# EAGLE design PiKVM_USB_Adapter v1 (EAGLE 9.6.2)
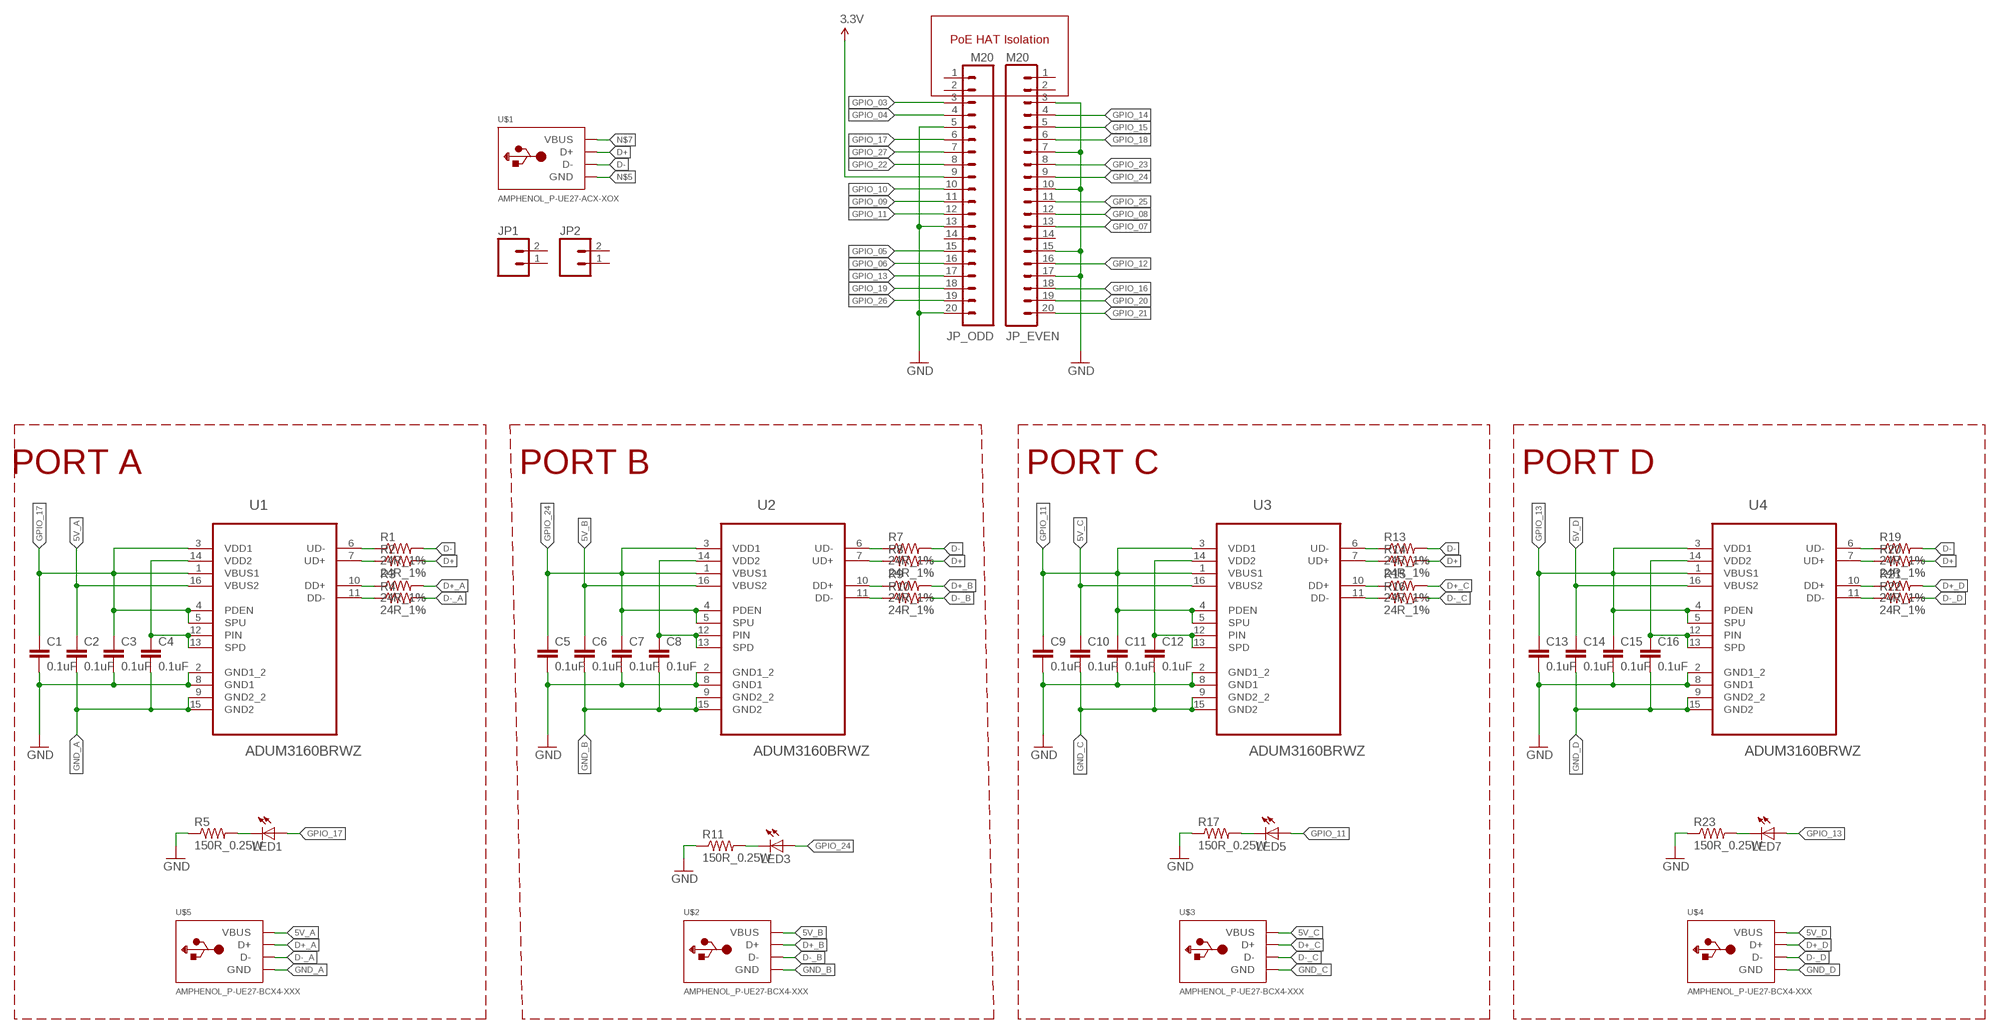
[diagram p0: schematic, sheet 1]

## Parts
C1  0.1uF  CAP0805  [0805]
C2  0.1uF  CAP0805  [0805]
C3  0.1uF  CAP0805  [0805]
C4  0.1uF  CAP0805  [0805]
C5  0.1uF  CAP0805  [0805]
C6  0.1uF  CAP0805  [0805]
C7  0.1uF  CAP0805  [0805]
C8  0.1uF  CAP0805  [0805]
C9  0.1uF  CAP0805  [0805]
C10  0.1uF  CAP0805  [0805]
C11  0.1uF  CAP0805  [0805]
C12  0.1uF  CAP0805  [0805]
C13  0.1uF  CAP0805  [0805]
C14  0.1uF  CAP0805  [0805]
C15  0.1uF  CAP0805  [0805]
C16  0.1uF  CAP0805  [0805]
JP1  M02LOCK  [1X02_LOCK]
JP2  M02LOCK  [1X02_LOCK]
JP_EVEN  M20  [1X20]
JP_ODD  M20  [1X20]
LED1  LED1206  [LED-1206]
LED3  LED1206  [LED-1206]
LED5  LED1206  [LED-1206]
LED7  LED1206  [LED-1206]
R1  24R_1%  RESISTOR0805-RES  [0805]
R2  24R_1%  RESISTOR0805-RES  [0805]
R3  24R_1%  RESISTOR0805-RES  [0805]
R4  24R_1%  RESISTOR0805-RES  [0805]
R5  150R_0.25W  RESISTOR1206  [1206]
R7  24R_1%  RESISTOR0805-RES  [0805]
R8  24R_1%  RESISTOR0805-RES  [0805]
R9  24R_1%  RESISTOR0805-RES  [0805]
R10  24R_1%  RESISTOR0805-RES  [0805]
R11  150R_0.25W  RESISTOR1206  [1206]
R13  24R_1%  RESISTOR0805-RES  [0805]
R14  24R_1%  RESISTOR0805-RES  [0805]
R15  24R_1%  RESISTOR0805-RES  [0805]
R16  24R_1%  RESISTOR0805-RES  [0805]
R17  150R_0.25W  RESISTOR1206  [1206]
R19  24R_1%  RESISTOR0805-RES  [0805]
R20  24R_1%  RESISTOR0805-RES  [0805]
R21  24R_1%  RESISTOR0805-RES  [0805]
R22  24R_1%  RESISTOR0805-RES  [0805]
R23  150R_0.25W  RESISTOR1206  [1206]
U1  ADUM3160BRWZ  [SOIC127P1032X265-16N]
U2  ADUM3160BRWZ  [SOIC127P1032X265-16N]
U3  ADUM3160BRWZ  [SOIC127P1032X265-16N]
U4  ADUM3160BRWZ  [SOIC127P1032X265-16N]
U$1  AMPHENOL_P-UE27-ACX-XOX  [USBA_AMPHENOL-UE27-RA]
U$2  AMPHENOL_P-UE27-BCX4-XXX  [USBB_AMPHENOL-UE27-BC]
U$3  AMPHENOL_P-UE27-BCX4-XXX  [USBB_AMPHENOL-UE27-BC]
U$4  AMPHENOL_P-UE27-BCX4-XXX  [USBB_AMPHENOL-UE27-BC]
U$5  AMPHENOL_P-UE27-BCX4-XXX  [USBB_AMPHENOL-UE27-BC]

## Nets
3.3V: JP_ODD.9
5V_A: C2.1 U1.16(VBUS2) U$5.P$1(VBUS)
5V_B: C6.1 U2.16(VBUS2) U$2.P$1(VBUS)
5V_C: C10.1 U3.16(VBUS2) U$3.P$1(VBUS)
5V_D: C14.1 U4.16(VBUS2) U$4.P$1(VBUS)
D+: R2.2 R8.2 R14.2 R20.2 U$1.P$3(D+)
D+_A: R3.2 U$5.P$3(D+)
D+_B: R9.2 U$2.P$3(D+)
D+_C: R15.2 U$3.P$3(D+)
D+_D: R21.2 U$4.P$3(D+)
D-: R1.2 R7.2 R13.2 R19.2 U$1.P$2(D-)
D-_A: R4.2 U$5.P$2(D-)
D-_B: R10.2 U$2.P$2(D-)
D-_C: R16.2 U$3.P$2(D-)
D-_D: R22.2 U$4.P$2(D-)
GND: C1.2 C3.2 C5.2 C7.2 C9.2 C11.2 C13.2 C15.2 JP_EVEN.3 JP_EVEN.7 JP_EVEN.10 JP_EVEN.15 JP_EVEN.17 JP_ODD.5 JP_ODD.13 JP_ODD.20 R5.1 R11.1 R17.1 R23.1 U1.2(GND1_2) U1.8(GND1) U2.2(GND1_2) U2.8(GND1) U3.2(GND1_2) U3.8(GND1) U4.2(GND1_2) U4.8(GND1)
GND_A: C2.2 C4.2 U1.9(GND2_2) U1.15(GND2) U$5.P$4(GND)
GND_B: C6.2 C8.2 U2.9(GND2_2) U2.15(GND2) U$2.P$4(GND)
GND_C: C10.2 C12.2 U3.9(GND2_2) U3.15(GND2) U$3.P$4(GND)
GND_D: C14.2 C16.2 U4.9(GND2_2) U4.15(GND2) U$4.P$4(GND)
GPIO_03: JP_ODD.3
GPIO_04: JP_ODD.4
GPIO_05: JP_ODD.15
GPIO_06: JP_ODD.16
GPIO_07: JP_EVEN.13
GPIO_08: JP_EVEN.12
GPIO_09: JP_ODD.11
GPIO_10: JP_ODD.10
GPIO_11: C9.1 C11.1 JP_ODD.12 LED5.A U3.1(VBUS1) U3.3(VDD1) U3.4(PDEN) U3.5(SPU)
GPIO_12: JP_EVEN.16
GPIO_13: C13.1 C15.1 JP_ODD.17 LED7.A U4.1(VBUS1) U4.3(VDD1) U4.4(PDEN) U4.5(SPU)
GPIO_14: JP_EVEN.4
GPIO_15: JP_EVEN.5
GPIO_16: JP_EVEN.18
GPIO_17: C1.1 C3.1 JP_ODD.6 LED1.A U1.1(VBUS1) U1.3(VDD1) U1.4(PDEN) U1.5(SPU)
GPIO_18: JP_EVEN.6
GPIO_19: JP_ODD.18
GPIO_20: JP_EVEN.19
GPIO_21: JP_EVEN.20
GPIO_22: JP_ODD.8
GPIO_23: JP_EVEN.8
GPIO_24: C5.1 C7.1 JP_EVEN.9 LED3.A U2.1(VBUS1) U2.3(VDD1) U2.4(PDEN) U2.5(SPU)
GPIO_25: JP_EVEN.11
GPIO_26: JP_ODD.19
GPIO_27: JP_ODD.7
N$1: C8.1 U2.12(PIN) U2.13(SPD) U2.14(VDD2)
N$2: R7.1 U2.6(UD-)
N$3: R8.1 U2.7(UD+)
N$4: R9.1 U2.10(DD+)
N$5: U$1.P$4(GND)
N$6: R10.1 U2.11(DD-)
N$7: U$1.P$1(VBUS)
N$8: LED3.C R11.2
N$9: C12.1 U3.12(PIN) U3.13(SPD) U3.14(VDD2)
N$10: R13.1 U3.6(UD-)
N$11: R14.1 U3.7(UD+)
N$12: R15.1 U3.10(DD+)
N$13: R16.1 U3.11(DD-)
N$15: LED5.C R17.2
N$16: C16.1 U4.12(PIN) U4.13(SPD) U4.14(VDD2)
N$17: R19.1 U4.6(UD-)
N$18: LED1.C R5.2
N$19: C4.1 U1.12(PIN) U1.13(SPD) U1.14(VDD2)
N$20: R20.1 U4.7(UD+)
N$21: R21.1 U4.10(DD+)
N$22: R22.1 U4.11(DD-)
N$23: R1.1 U1.6(UD-)
N$24: R2.1 U1.7(UD+)
N$25: R3.1 U1.10(DD+)
N$26: R4.1 U1.11(DD-)
N$28: LED7.C R23.2
Unconnected: JP1.1 JP1.2 JP2.1 JP2.2 JP_EVEN.1 JP_EVEN.2 JP_EVEN.14 JP_ODD.1 JP_ODD.2 JP_ODD.14

## Notes on the sheet
- PoE HAT Isolation
- PORT A | PORT B | PORT C | PORT D

## Library data of the parts
C1-C16 = SparkFun-Capacitors:CAP: Capacitor Standard 0603 ceramic capacitor, and 0.1" leaded capacitor.
JP1 JP2 = SparkFun-Connectors:M02: Header 2 Standard 2-pin 0.1" header. Use with straight break away headers (SKU : PRT-00116), right angle break away headers (PRT-00553), swiss pins (PRT-00743), machine pins (PRT-00117), and female headers (PRT-00115). Molex polarized connector foot print use with SKU : PRT-08233 with associated crimp pins and housings.
JP_EVEN JP_ODD = SparkFun-Connectors:M20: 1x20 .1" header This is just like the LOCK variant in that the holes are staggared by 5 mil, but except for the last two holes. They are not altered from the "standard" footprint layout. This is used for a special purpose on the layout of our Graphic LCD Backpack. Make sure you want to use this device before selecting it for you project!
LED1 LED3 LED5 LED7 = SparkFun-LED:LED: LEDs Standard schematic elements and footprints for 5mm, 3mm, 1206, and 0603 sized LEDs. 5mm - Spark Fun Electronics SKU : COM-00529 (and others)
R1-R5 R7-R11 R13-R17 R19-R23 = SparkFun-Resistors:RESISTOR: Resistor Basic schematic elements and footprints for 0603, 1206, and PTH resistors.
U1-U4 = Analog Devices_By_element14_Batch_1:ADUM3160BRWZ: Full/Low Speed 2.5 kV USB Digital Isolator; MPN: ADUM3160BRWZ; OC_FARNELL: 1843660; OC_NEWARK: 85R6420; PACKAGE: SOIC-16; SUPPLIER: Analog Devices
U$1 = adafruit:AMPHENOL_P-UE27-ACX-XOX
U$2-U$5 = adafruit:AMPHENOL_P-UE27-BCX4-XXX

## Board
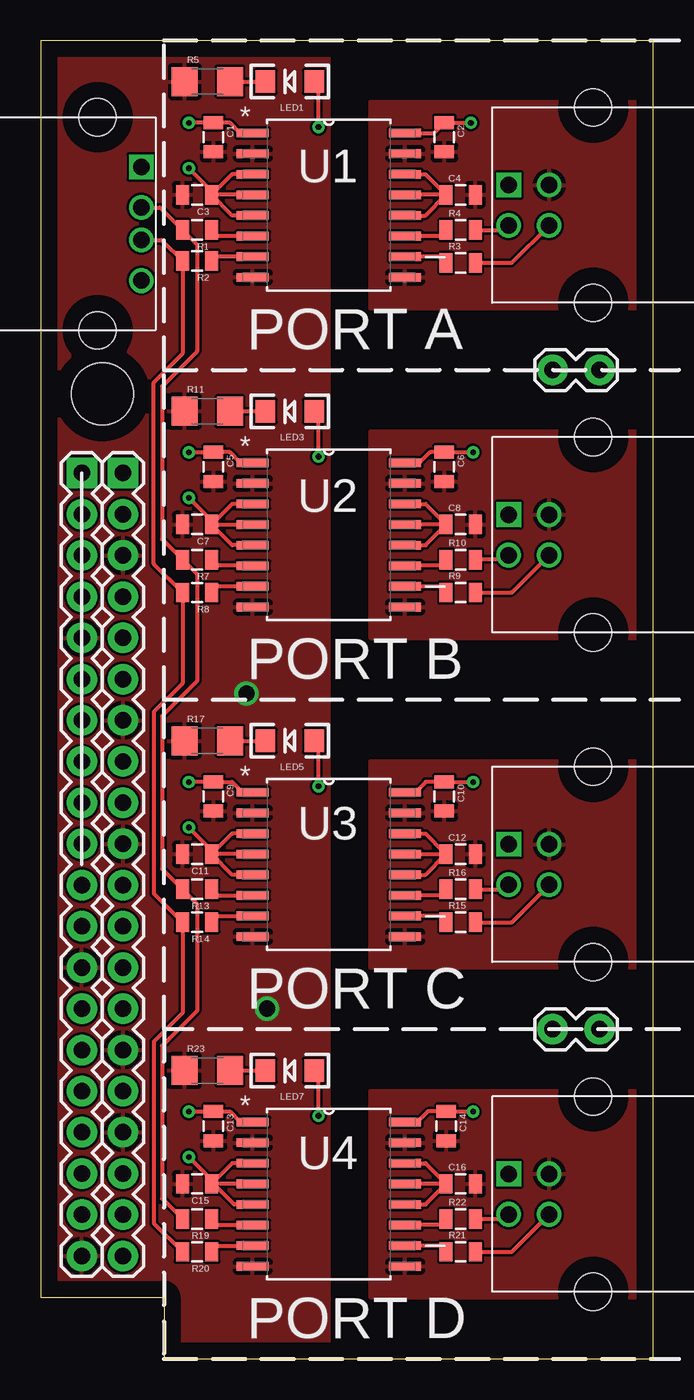
[diagram p1: board, top side]
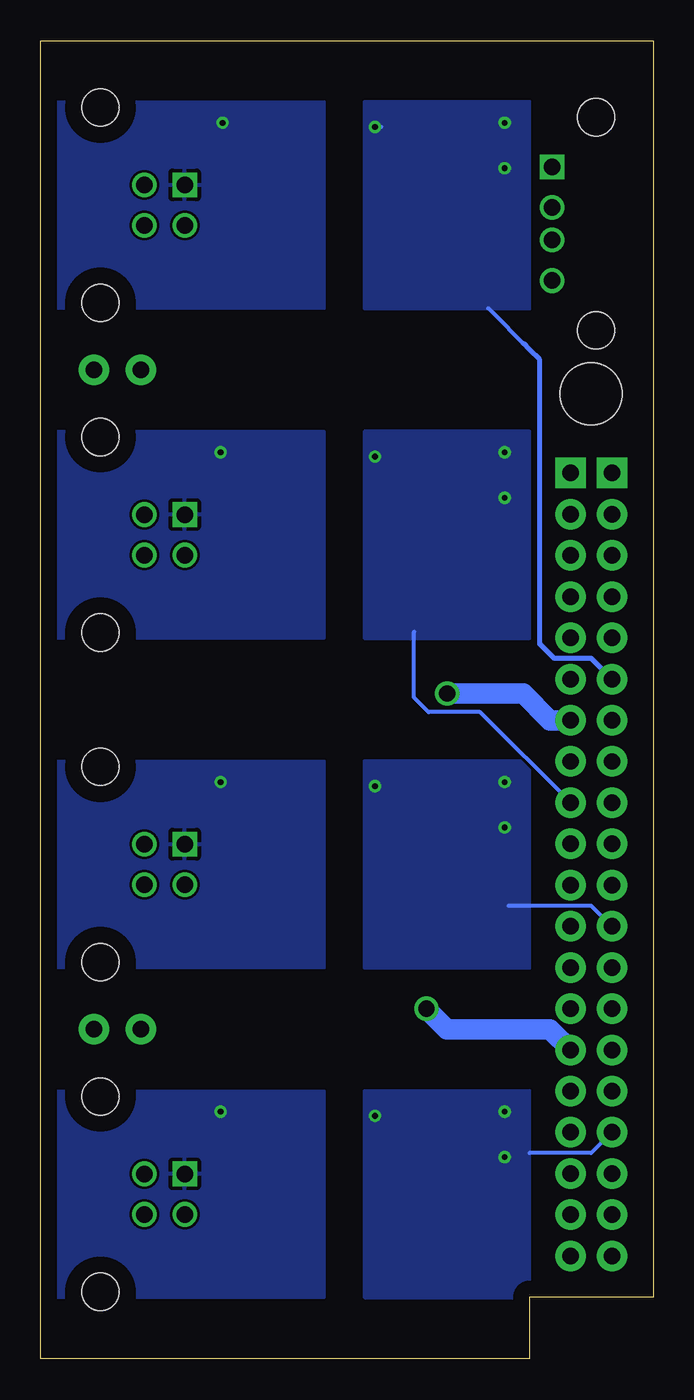
[diagram p2: board, bottom side, seen from below]

Size 37.77 x 81.27 mm. Coordinates in mm from the lower left corner, seen from the top.
Outline: 0,3.81 7.62,3.81 7.62,0 37.77,0 37.77,81.27 0,81.27 0,3.81
Copper layers (1*16): Top 0.035mm / dielectric 1.5mm / Bottom 0.035mm
Design rules "default": minimum track width 6mil, minimum drill 0.35mm, track to track 6mil, track to pad 6mil, pad to pad 6mil, via to via 6mil, smd to smd 6mil, copper to edge 40mil, drill to drill 6mil, minimum pad ring 10mil, minimum via ring 8mil, stop-mask expansion 4mil, vias tented up to drill 0mil, thermal gap 10mil
Holes 3.81 mm at 3.81,59.49

### Footprints (pad centres in the part's own frame; a part is rotated, then mirrored left to right if it is on the bottom)
0805 = smd 0.8 x 1.2: 1 -0.9,0; 2 0.9,0
1X02_LOCK = drill 1.016 pad 1.88: 1 -0.178,0; 2 2.718,0
1X20 = drill 1.016 pad 1.88 square: 1 0,0 | drill 1.016 pad 1.88: 2 2.54,0; 3 5.08,0; 4 7.62,0; 5 10.16,0; 6 12.7,0; 7 15.24,0; 8 17.78,0; 9 20.32,0; 10 22.86,0; 11 25.4,0; 12 27.94,0; 13 30.48,0; 14 33.02,0; 15 35.56,0; 16 38.1,0; 17 40.64,0; 18 43.18,0; 19 45.72,0; 20 48.26,0
LED-1206 = smd 1.2 x 1.4: A -1.5,0; C 1.5,0
1206 = smd 1.6 x 1.8: 1 -1.4,0; 2 1.4,0
SOIC127P1032X265-16N = smd 1.981 x 0.533: 1 -4.699,4.445; 2 -4.699,3.175; 3 -4.699,1.905; 4 -4.699,0.635; 5 -4.699,-0.635; 6 -4.699,-1.905; 7 -4.699,-3.175; 8 -4.699,-4.445; 9 4.699,-4.445; 10 4.699,-3.175; 11 4.699,-1.905; 12 4.699,-0.635; 13 4.699,0.635; 14 4.699,1.905; 15 4.699,3.175; 16 4.699,4.445
USBA_AMPHENOL-UE27-RA = drill 1.016 square: P$1 -3.5,0 | drill 1.016: P$2 -1.001,0; P$3 1.001,0; P$4 3.5,0 | hole 2.286: -6.571,-2.71; 6.571,-2.71
USBB_AMPHENOL-UE27-BC = drill 1.016 square: P$1 1.25,2.492 | drill 1.016: P$2 -1.25,2.499; P$3 -1.25,0; P$4 1.25,0 | hole 2.286: -6.02,-2.71; 6.02,-2.71

### Placement (x,y rotation side)
C1  10.67,75.31 270 top
C2  24.89,75.31 270 top
C3  9.65,71.75 180 top
C4  25.91,71.75 0 top
C5  10.67,54.99 270 top
C6  24.89,54.99 270 top
C7  9.65,51.43 180 top
C8  25.91,51.43 0 top
C9  10.67,34.67 270 top
C10  24.89,34.67 270 top
C11  9.65,31.12 180 top
C12  25.91,31.12 0 top
C13  10.67,14.35 270 top
C14  25.02,14.35 270 top
C15  9.65,10.79 180 top
C16  25.91,10.79 0 top
JP1  31.75,60.96 0 top
JP2  31.75,20.32 0 top
JP_EVEN  5.08,54.61 270 top
JP_ODD  2.54,54.61 270 top
LED1  15.37,78.74 180 top
LED3  15.37,58.42 180 top
LED5  15.37,38.1 180 top
LED7  15.37,17.78 180 top
R1  9.65,69.6 180 top
R2  9.65,67.69 180 top
R3  25.91,67.56 0 top
R4  25.91,69.6 0 top
R5  10.29,78.74 0 top
R7  9.65,49.28 180 top
R8  9.65,47.24 180 top
R9  25.91,47.24 0 top
R10  25.91,49.28 0 top
R11  10.29,58.42 0 top
R13  9.65,28.96 180 top
R14  9.65,26.92 180 top
R15  25.91,26.92 0 top
R16  25.91,28.96 0 top
R17  10.29,38.1 0 top
R19  9.65,8.64 180 top
R20  9.65,6.6 180 top
R21  25.91,6.6 0 top
R22  25.91,8.64 0 top
R23  10.29,17.78 0 top
U1  17.78,71.12 0 top
U2  17.78,50.8 0 top
U3  17.78,30.48 0 top
U4  17.78,10.16 0 top
U$1  6.22,69.98 270 top
U$2  31.37,50.8 90 top
U$3  31.37,30.48 90 top
U$4  31.37,10.16 90 top
U$5  31.37,71.12 90 top

### Tracks (layer width: path | path; a pad name or v marks a point on that pad's centre or on a via)
5V_A  (via drill 0.35)
  Top 0.254: 22.49,75.58 U1.16 24.25,75.56 C2.1 26.53,76.21 v26.54,76.2
  Bottom 0.254: v26.54,76.2 26.8,76.2
  Bottom 0.305: U$5.P$1 28.85,72.37
  pour Bottom: 20.32,64.77 38.1,64.77 38.1,77.47 20.32,77.47
5V_B  (via drill 0.35)
  Top 0.254: v26.67,55.88 26.66,55.89 C6.1 24.01,55.89 23.37,55.24 U2.16
  pour Bottom: 20.32,44.45 38.1,44.45 38.1,57.15 20.32,57.15
5V_C  (via drill 0.35)
  Top 0.254: U3.16 23.11,34.92 23.76,35.57 C10.1 26.66,35.57 v26.67,35.56
  pour Bottom: 20.32,24.13 38.1,24.13 38.1,36.83 20.32,36.83
5V_D  (via drill 0.35)
  Top 0.254: U4.16 23.24,14.6 23.89,15.25 C14.1 26.66,15.25 v26.67,15.24
  pour Bottom: 20.32,3.81 38.1,3.81 38.1,16.51 20.32,16.51
D+
  Top 0.254: U$1.P$3 7.47,68.98 R2.2 8.75,61.96 6.98,60.2 6.98,49.01 R8.2 8.75,41.65 6.98,39.88 6.98,28.69 R14.2 8.75,21.33 6.98,19.56 6.98,8.37 R20.2
D+_A
  Top 0.254: R3.2 29.06,67.56 U$5.P$3
D+_B
  Top 0.254: R9.2 29.06,47.24 U$2.P$3
D+_C
  Top 0.254: R15.2 29.06,26.92 U$3.P$3
D+_D
  Top 0.254: R21.2 29.06,6.6 U$4.P$3
D-
  Top 0.254: U$1.P$2 7.37,70.98 R1.2 9.65,68.7 9.65,62.1 7.49,59.94 7.49,50.54 R7.2 9.65,48.38 9.65,41.78 7.49,39.62 7.49,30.21 R13.2 9.65,28.06 9.65,21.46 7.49,19.3 7.49,9.89 R19.2
D-_A
  Top 0.254: R4.2 28.59,69.6 U$5.P$2
D-_B
  Top 0.254: 27.08,49.55 R10.2 28.59,49.28 U$2.P$2
D-_C
  Top 0.254: R16.2 28.59,28.96 U$3.P$2
D-_D
  Top 0.254: R22.2 28.59,8.64 U$4.P$2
GND  (via drill 1)
  Bottom 1.27: JP_EVEN.15 6.35,20.32 12.7,20.32 v13.97,21.59 | JP_EVEN.7 6.35,39.37 8,41.02 v12.7,41.02
  pour Top: -10.16,83.82 -10.16,-2.54 17.78,-2.54 17.78,83.82
GND_A
  pour Top: 20.32,77.47 20.32,64.77 39.37,64.77 39.37,77.47
GND_B
  pour Top: 20.32,57.15 20.32,44.45 39.37,44.45 39.37,57.15
GND_C
  pour Top: 20.32,36.83 20.32,24.13 39.37,24.13 39.37,36.83
GND_D
  pour Top: 20.32,16.51 20.32,3.81 39.37,3.81 39.37,16.51
GPIO_11  (via drill 0.35)
  Top 0.254: 17.27,37.7 LED5.A 17.14,37.82 v17.14,35.31 | v9.14,35.56 10.66,35.56 C9.1 11.8,35.57 12.45,34.92 U3.1 | C11.1 10.55,31.36 v9.14,32.77 | U3.5 11.82,29.84 C11.1 | U3.3 11.82,32.38 C11.1 | U3.4 C11.1
  Bottom 0.254: JP_ODD.12 3.81,27.94 8.89,27.94
  pour Bottom: 7.62,36.83 17.78,36.83 17.78,24.13 7.62,24.13
GPIO_13  (via drill 0.35)
  Top 0.254: U4.1 12.32,14.6 11.67,15.25 C13.1 10.66,15.24 v9.14,15.24 | U4.4 10.67,10.79 | 10.67,10.79 C15.1 | U4.3 11.82,12.06 C15.1 | U4.5 11.94,9.52 10.67,10.79 | v17.14,14.99 17.14,17.5 LED7.A | C15.1 10.55,11.04 v9.14,12.45
  Bottom 0.254: JP_ODD.17 3.81,12.7 7.62,12.7
  pour Bottom: 7.62,16.51 17.78,16.51 17.78,3.81 7.62,3.81
GPIO_17  (via drill 0.35)
  Top 0.254: U1.4 C3.1 | U1.3 11.82,73.03 C3.1 | U1.5 11.82,70.49 C3.1 | C1.1 | C1.1 v9.14,76.2 | v17.14,75.95 17.14,78.46 LED1.A | U1.1 12.32,75.56 11.68,76.2 C1.1 | C3.1 10.55,72 v9.14,73.41
  Bottom 0.254: v17.14,75.95 16.76,75.95 | 7.62,62.23 10.16,64.77
  Bottom 0.305: JP_ODD.6 3.81,43.18 6.1,43.18 6.98,44.07 6.98,61.6 7.62,62.23 8,62.61
  pour Bottom: 7.62,77.47 17.78,77.47 17.78,64.77 7.62,64.77
GPIO_24  (via drill 0.35)
  Top 0.254: v17.14,55.63 17.14,58.14 LED3.A | v9.14,55.88 10.66,55.88 C5.1 11.67,55.89 12.32,55.24 U2.1 | C7.1 U2.4 | U2.3 11.82,52.71 C7.1 | U2.5 11.82,50.16 C7.1 | v9.14,53.09 10.55,51.68 C7.1
  Bottom 0.254: JP_EVEN.9 10.67,39.88 13.84,39.88 14.73,40.77 14.73,44.83
  pour Bottom: 7.62,57.15 17.78,57.15 17.78,44.45 7.62,44.45
N$1
  Top 0.254: C8.1 U2.13 | U2.14 23.74,52.71 C8.1 | U2.12 23.74,50.16 C8.1
N$2
  Top 0.254: U2.6 10.93,48.9 R7.1
N$3
  Top 0.254: U2.7 10.93,47.62 R8.1
N$4
  Top 0.254: R9.1 24.63,47.62 U2.10
N$6
  Top 0.254: R10.1 24.63,48.9 U2.11
N$8
  Top 0.254: R11.2 LED3.C
N$9
  Top 0.254: U3.14 23.74,32.38 24.89,31.24 | 24.89,31.24 C12.1 23.74,29.84 U3.12 | U3.13 24.77,31.12 24.89,31.24
N$10
  Top 0.254: R13.1 10.93,28.58 U3.6
N$11
  Top 0.254: R14.1 10.93,27.3 U3.7
N$12
  Top 0.254: R15.1 24.63,27.3 U3.10
N$13
  Top 0.254: R16.1 24.63,28.58 U3.11
N$15
  Top 0.254: R17.2 LED5.C
N$16
  Top 0.254: C16.1 U4.13 | U4.14 23.74,12.06 C16.1 | U4.12 23.74,9.52 C16.1
N$17
  Top 0.254: R19.1 10.93,8.25 U4.6
N$18
  Top 0.254: R5.2 LED1.C
N$19
  Top 0.254: U1.12 23.74,70.49 C4.1 | C4.1 U1.13 | U1.14 23.74,73.03 C4.1
N$20
  Top 0.254: R20.1 10.93,6.98 U4.7
N$21
  Top 0.254: R21.1 24.63,6.98 U4.10
N$22
  Top 0.254: R22.1 24.63,8.25 U4.11
N$23
  Top 0.254: U1.6 10.93,69.22 R1.1
N$24
  Top 0.254: U1.7 10.81,67.94 R2.1
N$25
  Top 0.254: 24.63,67.94 U1.10
  Top 0.305: R3.1 24.63,67.94
N$26
  Top 0.254: 24.63,69.22 U1.11
  Top 0.305: R4.1 24.63,69.22
N$28
  Top 0.254: R23.2 LED7.C

### Text on the board
tNames: PORT A | PORT B | PORT C | PORT D